# EAGLE design tritiled-0603 (EAGLE 9.6.1)
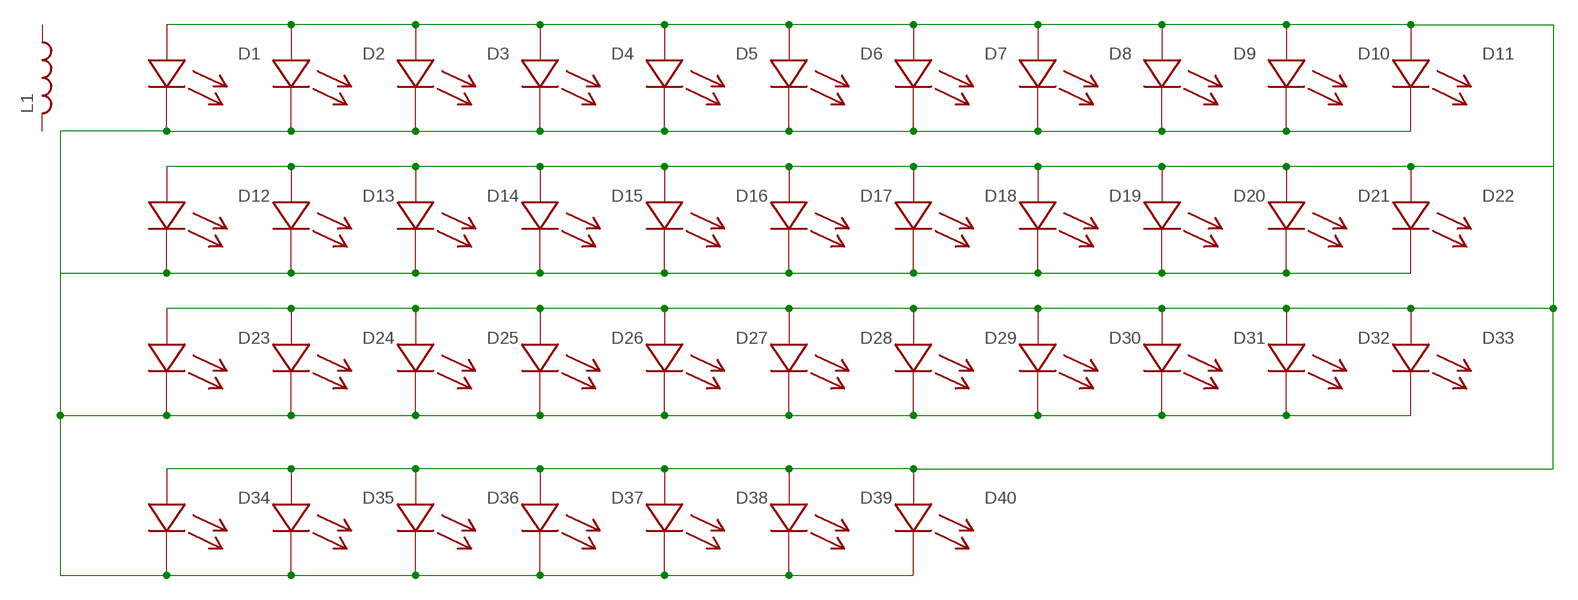
[diagram p0: schematic, sheet 1]

## Parts
D1  LED  [LED_0603]
D2  LED  [LED_0603]
D3  LED  [LED_0603]
D4  LED  [LED_0603]
D5  LED  [LED_0603]
D6  LED  [LED_0603]
D7  LED  [LED_0603]
D8  LED  [LED_0603]
D9  LED  [LED_0603]
D10  LED  [LED_0603]
D11  LED  [LED_0603]
D12  LED  [LED_0603]
D13  LED  [LED_0603]
D14  LED  [LED_0603]
D15  LED  [LED_0603]
D16  LED  [LED_0603]
D17  LED  [LED_0603]
D18  LED  [LED_0603]
D19  LED  [LED_0603]
D20  LED  [LED_0603]
D21  LED  [LED_0603]
D22  LED  [LED_0603]
D23  LED  [LED_0603]
D24  LED  [LED_0603]
D25  LED  [LED_0603]
D26  LED  [LED_0603]
D27  LED  [LED_0603]
D28  LED  [LED_0603]
D29  LED  [LED_0603]
D30  LED  [LED_0603]
D31  LED  [LED_0603]
D32  LED  [LED_0603]
D33  LED  [LED_0603]
D34  LED  [LED_0603]
D35  LED  [LED_0603]
D36  LED  [LED_0603]
D37  LED  [LED_0603]
D38  LED  [LED_0603]
D39  LED  [LED_0603]
D40  LED  [LED_0603]
L1  SRR6028_INDUCTOR  [SRR6028_INDUCTOR]

## Nets
N$1: D1.C D2.C D3.C D4.C D5.C D6.C D7.C D8.C D9.C D10.C D11.C D12.C D13.C D14.C D15.C D16.C D17.C D18.C D19.C D20.C D21.C D22.C D23.C D24.C D25.C D26.C D27.C D28.C D29.C D30.C D31.C D32.C D33.C D34.C D35.C D36.C D37.C D38.C D39.C D40.C
N$4: D1.A D2.A D3.A D4.A D5.A D6.A D7.A D8.A D9.A D10.A D11.A D12.A D13.A D14.A D15.A D16.A D17.A D18.A D19.A D20.A D21.A D22.A D23.A D24.A D25.A D26.A D27.A D28.A D29.A D30.A D31.A D32.A D33.A D34.A D35.A D36.A D37.A D38.A D39.A D40.A
Unconnected: L1.P$1 L1.P$2

## Library data of the parts
D1-D40 = yapo:LED
L1 = yapo:SRR6028_INDUCTOR

## Board
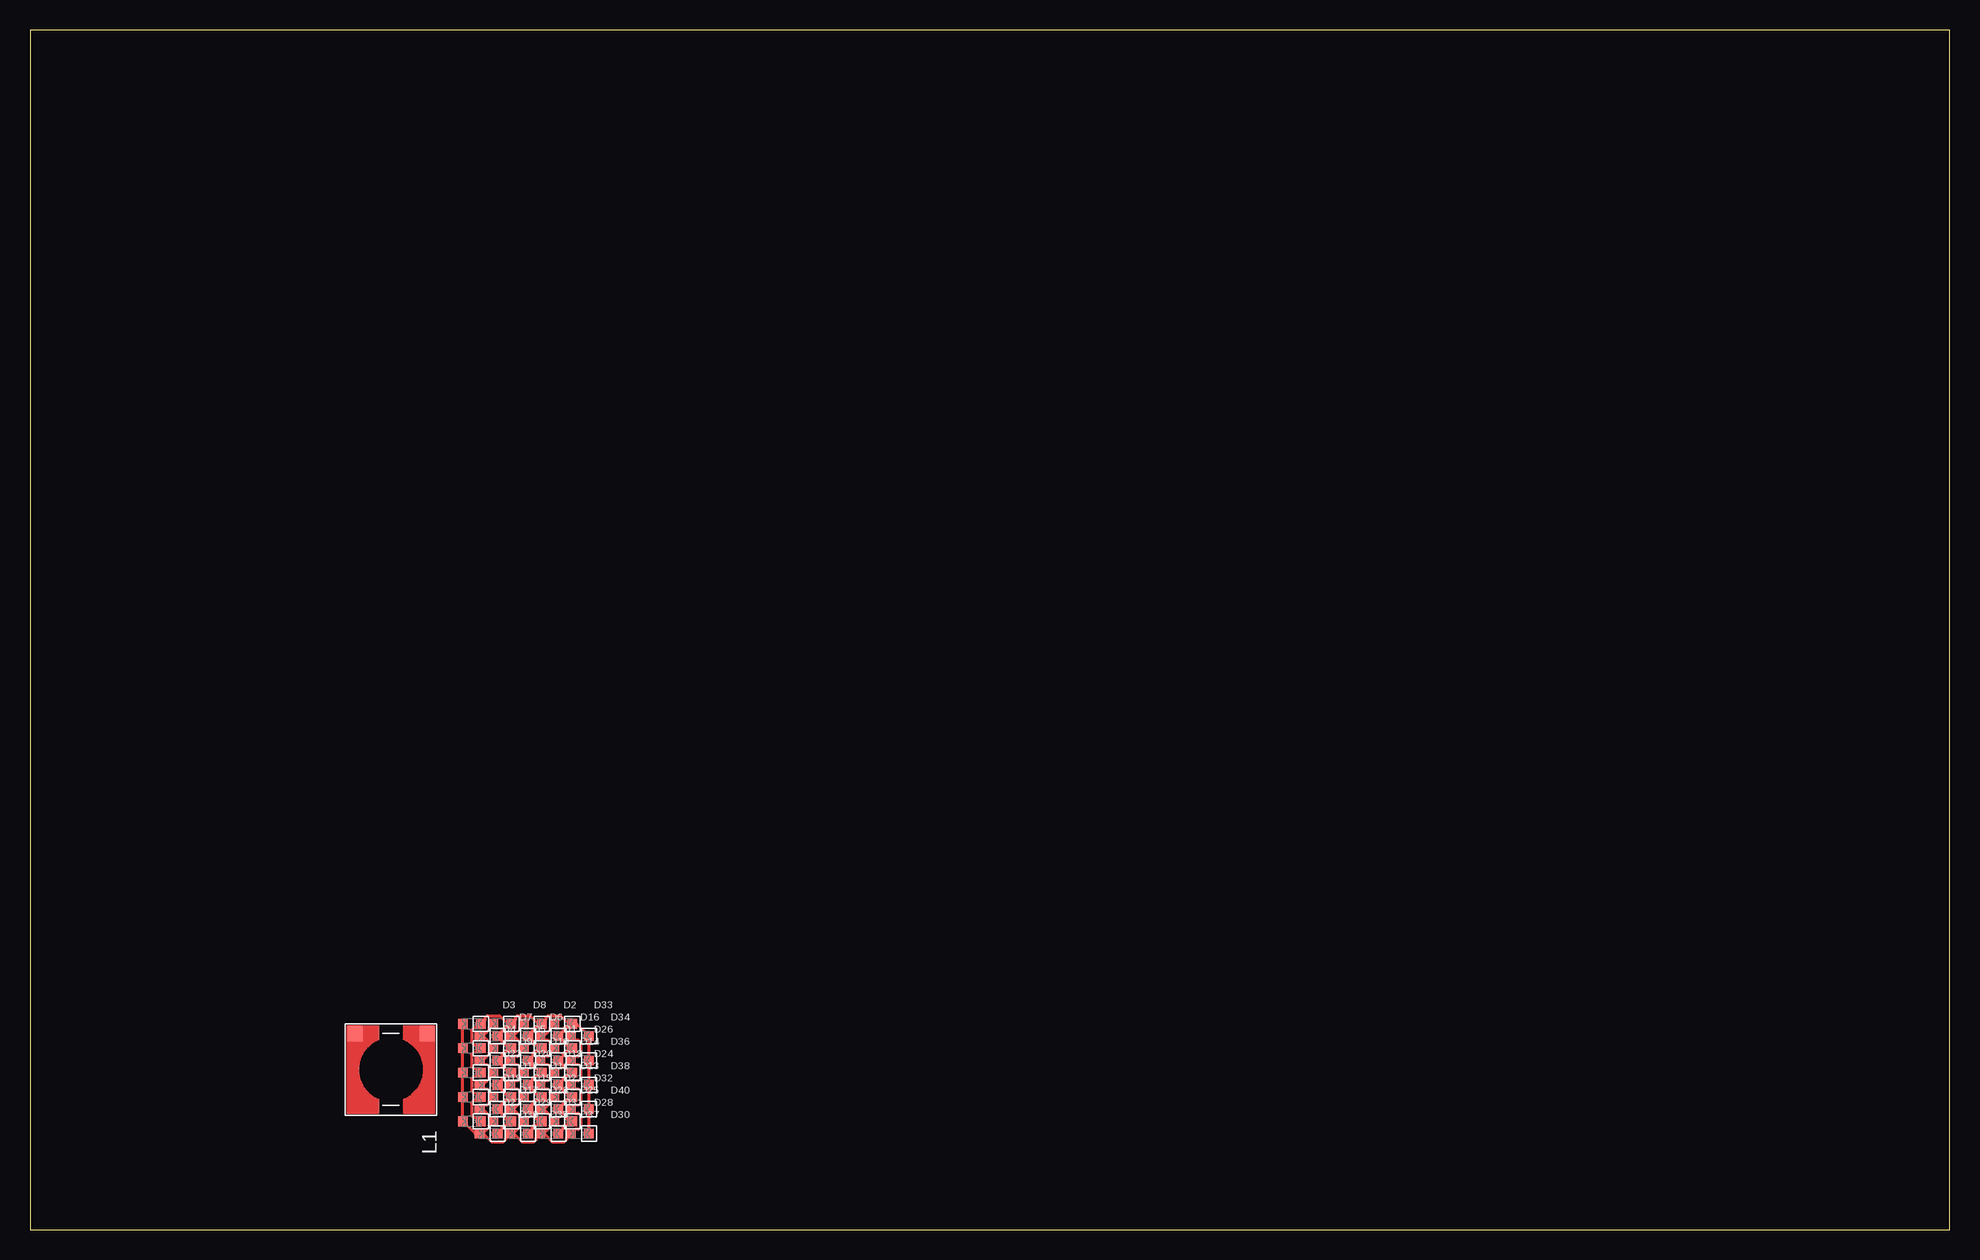
[diagram p1: board, top side]

Size 160 x 100 mm. Coordinates in mm from the lower left corner, seen from the top.
Outline: 0,0 160,0 160,100 0,100 0,0
Copper layers (1*16): Top 0.035559375mm / dielectric 1.6mm / Bottom 0.035559375mm
Design rules "oshpark-2layer": minimum track width 6mil, minimum drill 10mil, track to track 6mil, track to pad 6mil, pad to pad 6mil, via to via 6mil, smd to smd 6mil, copper to edge 15mil, drill to drill 6mil, minimum pad ring 5mil, minimum via ring 5mil, stop-mask expansion 2.5mil, vias tented up to drill 0mil, thermal gap 10mil

### Footprints (pad centres in the part's own frame; a part is rotated, then mirrored left to right if it is on the bottom)
LED_0603 = smd 0.8 x 0.8: A -0.75,0; C 0.75,0
SRR6028_INDUCTOR = smd 1.27 x 1.27: P$1 -3,3; P$2 -3,-3

### Placement (x,y rotation side)
D1  41.91,15.11 0 top
D2  41.91,17.14 0 top
D3  36.83,17.14 0 top
D4  36.83,15.11 0 top
D5  39.37,15.11 0 top
D6  40.77,16.13 0 top
D7  38.23,16.13 0 top
D8  39.37,17.14 0 top
D9  38.23,14.1 0 top
D10  40.77,14.1 0 top
D11  40.77,12.06 0 top
D12  38.23,12.06 0 top
D13  43.31,12.06 0 top
D14  43.31,14.1 0 top
D15  39.37,11.05 0 top
D16  43.31,16.13 0 top
D17  38.23,10.03 0 top
D18  41.91,13.08 0 top
D19  36.83,11.05 0 top
D20  39.37,13.08 0 top
D21  41.91,11.05 0 top
D22  36.83,13.08 0 top
D23  40.77,10.03 0 top
D24  44.45,13.08 0 top
D25  43.31,10.03 0 top
D26  44.45,15.11 0 top
D27  36.83,9.02 0 top
D28  44.45,9.02 0 top
D29  39.37,9.02 0 top
D30  45.85,8 0 top
D31  41.91,9.02 0 top
D32  44.45,11.05 0 top
D33  44.45,17.14 0 top
D34  45.85,16.13 0 top
D35  40.77,8 0 top
D36  45.85,14.1 0 top
D37  43.31,8 0 top
D38  45.85,12.06 0 top
D39  38.23,8 0 top
D40  45.85,10.03 0 top
L1  30.1,13.34 270 top

### Tracks (layer width: path | path; a pad name or v marks a point on that pad's centre or on a via)
N$1
  Top 0.254: D8.C 39.78,16.81 39.5,16.81 39.34,16.64 39.34,16.49 D7.C 39.34,15.77 39.34,15.61 39.5,15.45 39.78,15.45 D5.C 39.78,14.78 39.5,14.78 39.34,14.61 39.34,14.46 D9.C 39.34,13.74 39.34,13.58 39.84,13.08 | D2.C 42.32,16.81 42.04,16.81 41.88,16.64 41.88,16.49 D6.C 41.88,15.77 41.88,15.61 42.04,15.45 42.32,15.45 D1.C 42.32,14.78 42.04,14.78 41.88,14.61 41.88,14.46 D10.C 41.88,13.74 41.88,13.58 42.04,13.42 42.32,13.42 D18.C 42.32,12.74 42.04,12.74 41.88,12.58 41.88,12.43 D11.C 41.88,11.7 41.88,11.55 42.38,11.05 D21.C 42.32,10.71 42.04,10.71 41.88,10.55 41.88,10.39 D23.C 41.88,9.67 41.88,9.52 42.38,9.02 D31.C 42.32,8.68 42.04,8.68 41.88,8.52 41.88,8.36 D35.C | D33.C 44.86,16.81 44.58,16.81 44.42,16.64 44.42,16.49 D16.C 44.42,15.77 44.42,15.61 44.92,15.11 D26.C 44.86,14.78 44.58,14.78 44.42,14.61 44.42,14.46 D14.C 44.42,13.74 44.42,13.58 44.58,13.42 44.86,13.42 D24.C 44.86,12.74 44.58,12.74 44.42,12.58 44.42,12.43 D13.C 44.42,11.7 44.42,11.55 44.58,11.39 44.86,11.39 D32.C 44.86,10.71 44.58,10.71 44.42,10.55 44.42,10.39 D25.C 44.42,9.67 44.42,9.52 44.92,9.02 D28.C 44.86,8.68 44.58,8.68 44.42,8.52 44.42,8.36 D37.C | D20.C 39.84,13.08 | 39.84,13.08 39.34,12.58 39.34,12.43 D12.C 39.34,11.7 39.34,11.55 39.84,11.05 D15.C 39.78,10.71 39.5,10.71 39.34,10.55 39.34,10.39 D17.C 39.34,9.67 39.34,9.52 39.84,9.02 D29.C 39.78,8.68 39.5,8.68 39.34,8.52 39.34,8.36 D39.C | D30.C D40.C D38.C D36.C D34.C 45.58,17.14 D33.C | D27.C 37.24,9.35 36.96,9.35 36.8,9.52 36.8,10.55 36.96,10.71 37.24,10.71 D19.C 37.24,11.39 36.96,11.39 36.8,11.55 36.8,12.58 36.96,12.74 37.24,12.74 D22.C 37.24,13.42 36.96,13.42 36.8,13.58 36.8,14.61 36.96,14.78 37.24,14.78 D4.C 37.24,15.45 36.96,15.45 36.8,15.61 36.8,16.64 36.96,16.81 37.24,16.81 D3.C 37.94,17.51 37.94,17.66 38.1,17.82 39.14,17.82 39.81,17.14 D8.C
  Top 0.254: D8.C 40.48,17.51 40.48,17.66 40.64,17.82 41.68,17.82 42.35,17.14 D2.C | D2.C 43.02,17.51 43.02,17.66 43.18,17.82 44.22,17.82 44.9,17.14 D33.C
N$4
  Top 0.254: D8.A 38.26,16.78 38.26,16.63 37.76,16.13 | D7.A 37.76,16.13 | 37.76,16.13 38.26,15.63 38.26,15.47 D5.A 38.26,14.75 38.26,14.6 37.76,14.1 D9.A 37.81,13.76 38.1,13.76 38.26,13.6 38.26,13.44 D20.A 38.26,12.72 38.26,12.56 37.76,12.06 D12.A 37.81,11.73 38.1,11.73 38.26,11.56 38.26,11.41 D15.A 38.26,10.69 38.26,10.53 38.1,10.37 37.81,10.37 D17.A 37.76,10.03 38.26,9.53 38.26,9.38 D29.A 38.26,8.66 38.26,8.5 37.76,8 D39.A | D2.A 40.8,16.78 40.8,16.63 40.3,16.13 | D6.A 40.3,16.13 | 40.3,16.13 40.8,15.63 40.8,15.47 D1.A 40.8,14.75 40.8,14.6 40.64,14.43 40.35,14.43 D10.A 40.35,13.76 40.64,13.76 40.8,13.6 40.8,13.44 D18.A 40.8,12.72 40.8,12.56 40.64,12.4 40.35,12.4 D11.A 40.35,11.73 40.64,11.73 40.8,11.56 40.8,11.41 D21.A 40.8,10.69 40.8,10.53 40.3,10.03 | D33.A 43.34,16.78 43.34,16.63 42.84,16.13 D16.A 42.89,15.79 43.18,15.79 43.34,15.63 43.34,15.47 D26.A 43.34,14.75 43.34,14.6 43.18,14.43 42.89,14.43 D14.A 42.89,13.76 43.18,13.76 43.34,13.6 43.34,13.44 D24.A 43.34,12.72 43.34,12.56 43.18,12.4 42.89,12.4 D13.A 42.89,11.73 43.18,11.73 43.34,11.56 43.34,11.41 D32.A 43.34,10.69 43.34,10.53 42.84,10.03 | D34.A 45.43,15.79 45.72,15.79 45.88,15.63 45.88,14.6 45.72,14.43 45.43,14.43 D36.A 45.43,13.76 45.72,13.76 45.88,13.6 45.88,12.56 45.72,12.4 45.43,12.4 D38.A 45.43,11.73 45.72,11.73 45.88,11.56 45.88,10.53 45.72,10.37 45.43,10.37 D40.A 45.43,9.7 45.72,9.7 45.88,9.53 45.88,8.5 45.72,8.34 45.43,8.34 D30.A 44.74,7.64 44.74,7.49 44.57,7.32 43.54,7.32 42.86,8 D37.A | D39.A 37.1,8 D27.A D19.A D22.A D4.A D3.A | D23.A 40.3,10.03
  Top 0.254: 40.3,10.03 40.8,9.53 40.8,9.38 D31.A 40.8,8.66 40.8,8.5 40.3,8 D35.A | D25.A 42.84,10.03 | 42.84,10.03 43.34,9.53 43.34,9.38 D28.A 43.34,8.66 43.34,8.5 42.84,8 D37.A | D39.A 37.78,8 38.46,7.32 39.49,7.32 39.66,7.49 39.66,7.64 D35.A | D35.A 40.32,8 41,7.32 42.03,7.32 42.2,7.49 42.2,7.64 D37.A